# Altium schematic sheet Sheet5.SchDoc
size A4; SheetNumber: 1; SheetTotal: 1
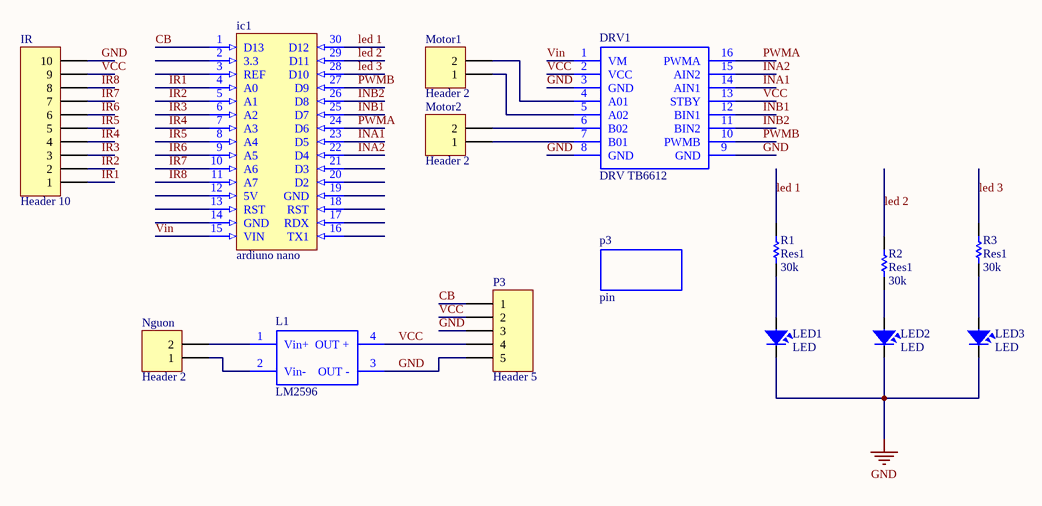
[diagram p0: Sheet5.SchDoc]

## Parts
(Parts that share a designator on the sheet are numbered #1, #2 ... from top to bottom, then left to right.)
DRV1  DRV TB6612  [DIP16]
ic1  ardiuno nano  [ardiuno nano]
IR  Header 10  [HDR1X10]
L1  LM2596  [DIP4 - duplicate]
LED1  LED  [LED-3]
LED2  LED  [LED-3]
LED3  LED  [LED-3]
Motor1  Header 2  [HDR1X2]
Motor2  Header 2  [HDR1X2]
Nguon  Header 2  [HDR1X2]
p3#1  pin  [pin]
P3#2  Header 5  [HDR1X5]
R1  Res1  value 30k  [AXIAL-0.3]
R2  Res1  value 30k  [AXIAL-0.3]
R3  Res1  value 30k  [AXIAL-0.3]

## Nets
GND: DRV1.3(GND) DRV1.8(GND) DRV1.9(GND) IR.10 L1.3(OUT_-) LED1.2 LED2.2 LED3.2 P3#2.3 P3#2.5
CB: ic1.1(D13) P3#2.1
INA1: DRV1.14(AIN1) ic1.23(D5)
INA2: DRV1.15(AIN2) ic1.22(D4)
INB1: DRV1.12(BIN1) ic1.25(D7)
INB2: DRV1.11(BIN2) ic1.26(D8)
IR1: ic1.4(A0) IR.1
IR2: ic1.5(A1) IR.2
IR3: ic1.6(A2) IR.3
IR4: ic1.7(A3) IR.4
IR5: ic1.8(A4) IR.5
IR6: ic1.9(A5) IR.6
IR7: ic1.10(A6) IR.7
IR8: ic1.11(A7) IR.8
led 1: ic1.30(D12) R1.2
led 2: ic1.29(D11) R2.2
led 3: ic1.28(D10) R3.2
PWMA: DRV1.16(PWMA) ic1.24(D6)
PWMB: DRV1.10(PWMB) ic1.27(D9)
VCC: DRV1.2(VCC) DRV1.13(STBY) IR.9 L1.4(OUT_+) P3#2.2 P3#2.4
Vin: DRV1.1(VM) ic1.15(VIN)
NetDRV1_4: DRV1.4(A01) Motor1.2
NetDRV1_5: DRV1.5(A02) Motor1.1
NetDRV1_6: DRV1.6(B02) Motor2.2
NetDRV1_7: DRV1.7(B01) Motor2.1
NetL1_1: L1.1(Vin+) Nguon.2
NetL1_2: L1.2(Vin-) Nguon.1
NetLED1_1: LED1.1 R1.1
NetLED2_1: LED2.1 R2.1
NetLED3_1: LED3.1 R3.1

Not connected (* = marked no-connect by the designer): ic1 2(3.3) 3(REF) 12(5V) 13(RST) 14(GND) 16(TX1) 17(RDX) 18(RST) 19(GND) 20(D2) 21(D3)

## Library data of the parts
DRV1 = DRN TB6612
IR = Header 10: Header, 10-Pin; LatestRevisionDate: 17-Jul-2002; LatestRevisionNote: Re-released for DXP Platform.; Publisher: Altium Limited
LED1-LED3 = LED: LED Single colour Green and Red; Value: LED 3 ly Single Colour
Motor1 Motor2 Nguon = Header 2: Header, 2-Pin; LatestRevisionDate: 17-Jul-2002; LatestRevisionNote: Re-released for DXP Platform.; Publisher: Altium Limited
P3#2 = Header 5: Header, 5-Pin; LatestRevisionDate: 17-Jul-2002; LatestRevisionNote: Re-released for DXP Platform.; Publisher: Altium Limited
R1-R3 = Res1: Resistor; Published: 8-Jun-2000; LatestRevisionDate: 17-Jul-2002; LatestRevisionNote: Re-released for DXP Platform.; PackageReference: AXIAL-0.3; Publisher: Altium Limited; PackageDescription: Axial Device, Thru-Hole; 2 Leads; 0.3 in Pin Spacing